# EAGLE schematic v0 (EAGLE 9.6.2)
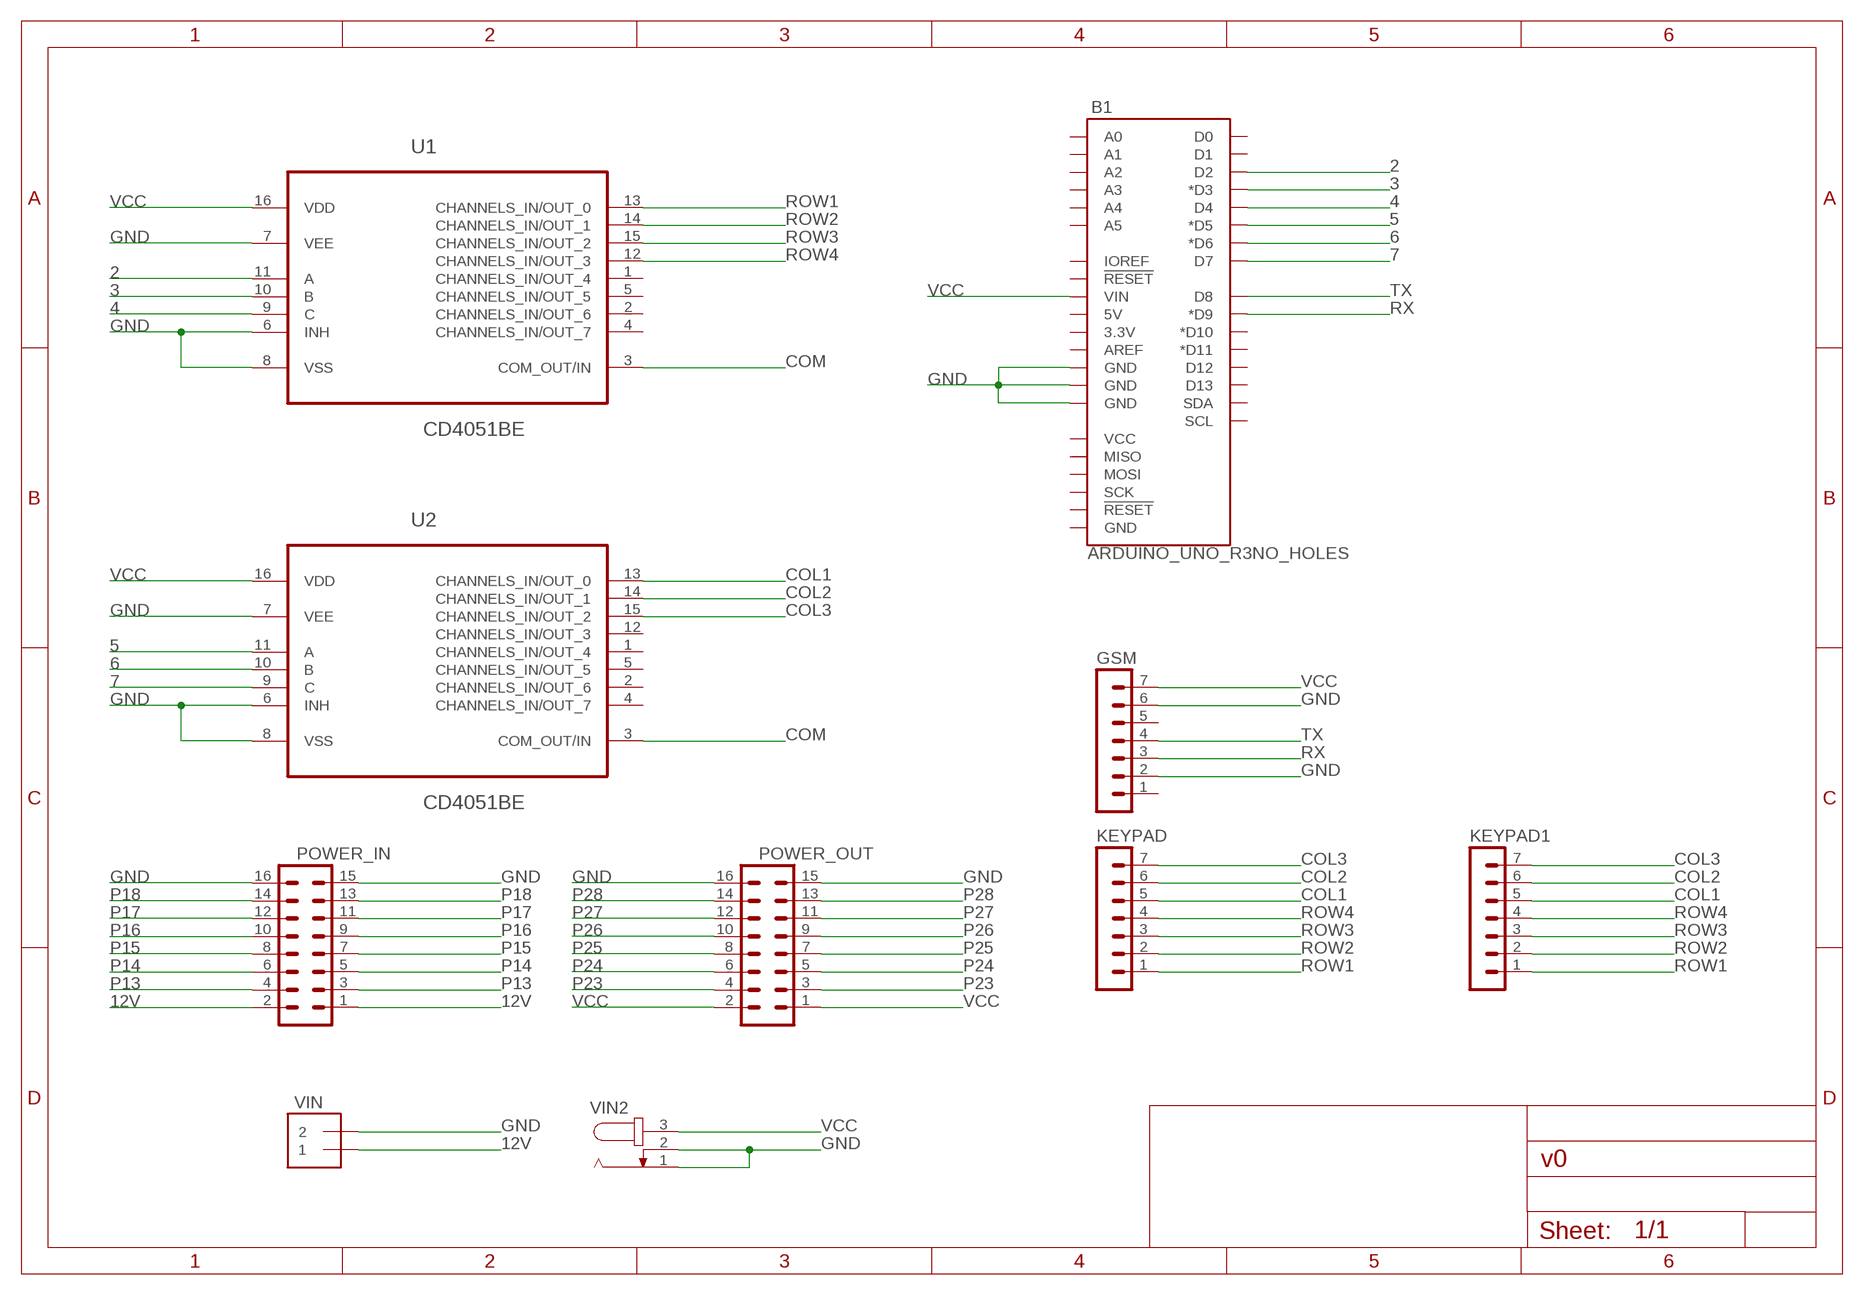
[diagram p0: schematic, sheet 1]

## Parts
B1  ARDUINO_UNO_R3NO_HOLES  [ARDUINO_R3_NO_HOLES]
GSM  MA07-1  [MA07-1]
KEYPAD  MA07-1  [MA07-1]
KEYPAD1  MA07-1  [MA07-1]
POWER_IN  MA08-2  [MA08-2]
POWER_OUT  MA08-2  [MA08-2]
U1  CD4051BE  [DIP254P762X508-16]
U2  CD4051BE  [DIP254P762X508-16]
VIN  1X2-3.5MM  [1X2-3.5MM]
VIN2  JACK-PLUG0  [SPC4077]

## Nets
2: B1.D2 U1.11(A)
3: B1.D3(*D3) U1.10(B)
4: B1.D4 U1.9(C)
5: B1.D5(*D5) U2.11(A)
6: B1.D6(*D6) U2.10(B)
7: B1.D7 U2.9(C)
12V [Power]: POWER_IN.1 POWER_IN.2 VIN.1
COL1: KEYPAD1.5 KEYPAD.5 U2.13(CHANNELS_IN/OUT_0)
COL2: KEYPAD1.6 KEYPAD.6 U2.14(CHANNELS_IN/OUT_1)
COL3: KEYPAD1.7 KEYPAD.7 U2.15(CHANNELS_IN/OUT_2)
COM: U1.3(COM_OUT/IN) U2.3(COM_OUT/IN)
GND [Power]: B1.GND@2(GND) B1.GND@3(GND) B1.GND@4(GND) GSM.2 GSM.6 POWER_IN.15 POWER_IN.16 POWER_OUT.15 POWER_OUT.16 U1.6(INH) U1.7(VEE) U1.8(VSS) U2.6(INH) U2.7(VEE) U2.8(VSS) VIN2.1 VIN2.2 VIN.2
P13: POWER_IN.3 POWER_IN.4
P14: POWER_IN.5 POWER_IN.6
P15: POWER_IN.7 POWER_IN.8
P16: POWER_IN.9 POWER_IN.10
P17: POWER_IN.11 POWER_IN.12
P18: POWER_IN.13 POWER_IN.14
P23: POWER_OUT.3 POWER_OUT.4
P24: POWER_OUT.5 POWER_OUT.6
P25: POWER_OUT.7 POWER_OUT.8
P26: POWER_OUT.9 POWER_OUT.10
P27: POWER_OUT.11 POWER_OUT.12
P28: POWER_OUT.13 POWER_OUT.14
ROW1: KEYPAD1.1 KEYPAD.1 U1.13(CHANNELS_IN/OUT_0)
ROW2: KEYPAD1.2 KEYPAD.2 U1.14(CHANNELS_IN/OUT_1)
ROW3: KEYPAD1.3 KEYPAD.3 U1.15(CHANNELS_IN/OUT_2)
ROW4: KEYPAD1.4 KEYPAD.4 U1.12(CHANNELS_IN/OUT_3)
RX: B1.D9(*D9) GSM.3
TX: B1.D8 GSM.4
VCC [Power]: B1.VIN GSM.7 POWER_OUT.1 POWER_OUT.2 U1.16(VDD) U2.16(VDD) VIN2.3
Unconnected: B1.3.3V B1.5V B1.A0 B1.A1 B1.A2 B1.A3 B1.A4 B1.A5 B1.AREF B1.D0 B1.D1 B1.D10(*D10) B1.D11(*D11) B1.D12 B1.D13 B1.GND@1(GND) B1.IOREF B1.MISO B1.MOSI B1.RESET@1(!RESET!) B1.RESET@2(!RESET!) B1.SCK B1.SCL B1.SDA B1.VCC GSM.1 GSM.5 U1.1(CHANNELS_IN/OUT_4) U1.2(CHANNELS_IN/OUT_6) U1.4(CHANNELS_IN/OUT_7) U1.5(CHANNELS_IN/OUT_5) U2.1(CHANNELS_IN/OUT_4) U2.2(CHANNELS_IN/OUT_6) U2.4(CHANNELS_IN/OUT_7) U2.5(CHANNELS_IN/OUT_5) U2.12(CHANNELS_IN/OUT_3)

## Library data of the parts
B1 = SparkFun-Boards:ARDUINO_UNO_R3: Arduino R3 Footprint with SPI header Arduino Uno R3 Compatible Footprint. Matches PCB size of the original board. SparkFun Products: SAMD21 Dev Breakout <https://www.sparkfun.com/products/13672> RedBoard <https://www.sparkfun.com/products/12757> R3 Stackable Headers <https://www.sparkfun.com/products/11417>
GSM KEYPAD KEYPAD1 = con-lstb:MA07-1: PIN HEADER; OC_FARNELL: unknown; OC_NEWARK: unknown
POWER_IN POWER_OUT = con-lstb:MA08-2: PIN HEADER; OC_FARNELL: unknown; OC_NEWARK: unknown
U1 U2 = Texas Instruments_By_element14_Batch_1:CD4051BE: The CD4051B is a single 8-Channel multiplexer having three binary control inputs.; MPN: CD4051BE; OC_FARNELL: 1106109; OC_NEWARK: 60K5119; PACKAGE: PDIP-16; SUPPLIER: Texas Instruments
VIN = adafruit:1X2: 3.5mm Terminal block http://www.ladyada.net/library/pcb/eaglelibrary.html
VIN2 = con-jack:JACK-PLUG: DC POWER JACK Power Jack, DC, Right Angle, Through Hole, Rated 5A at 16VDC, PC Terminals Distributor: Farnell (www.Farnell.de) Drawing: 84N1161.pdf / 84N1162.pdf Manufacturer: SPC Technology (www.spctechnology.com) Type: SPC4077 / SPC 4078; OC_FARNELL: unknown; OC_NEWARK: unknown

## Net classes
0 default: width 0.8 mm, drill 0.8 mm, clearance 0.4 mm
1 Power: width 1 mm, drill 0.8 mm, clearance 0.4 mm